# EAGLE design XOR_XNOR_1.1 (EAGLE 7.6.0)
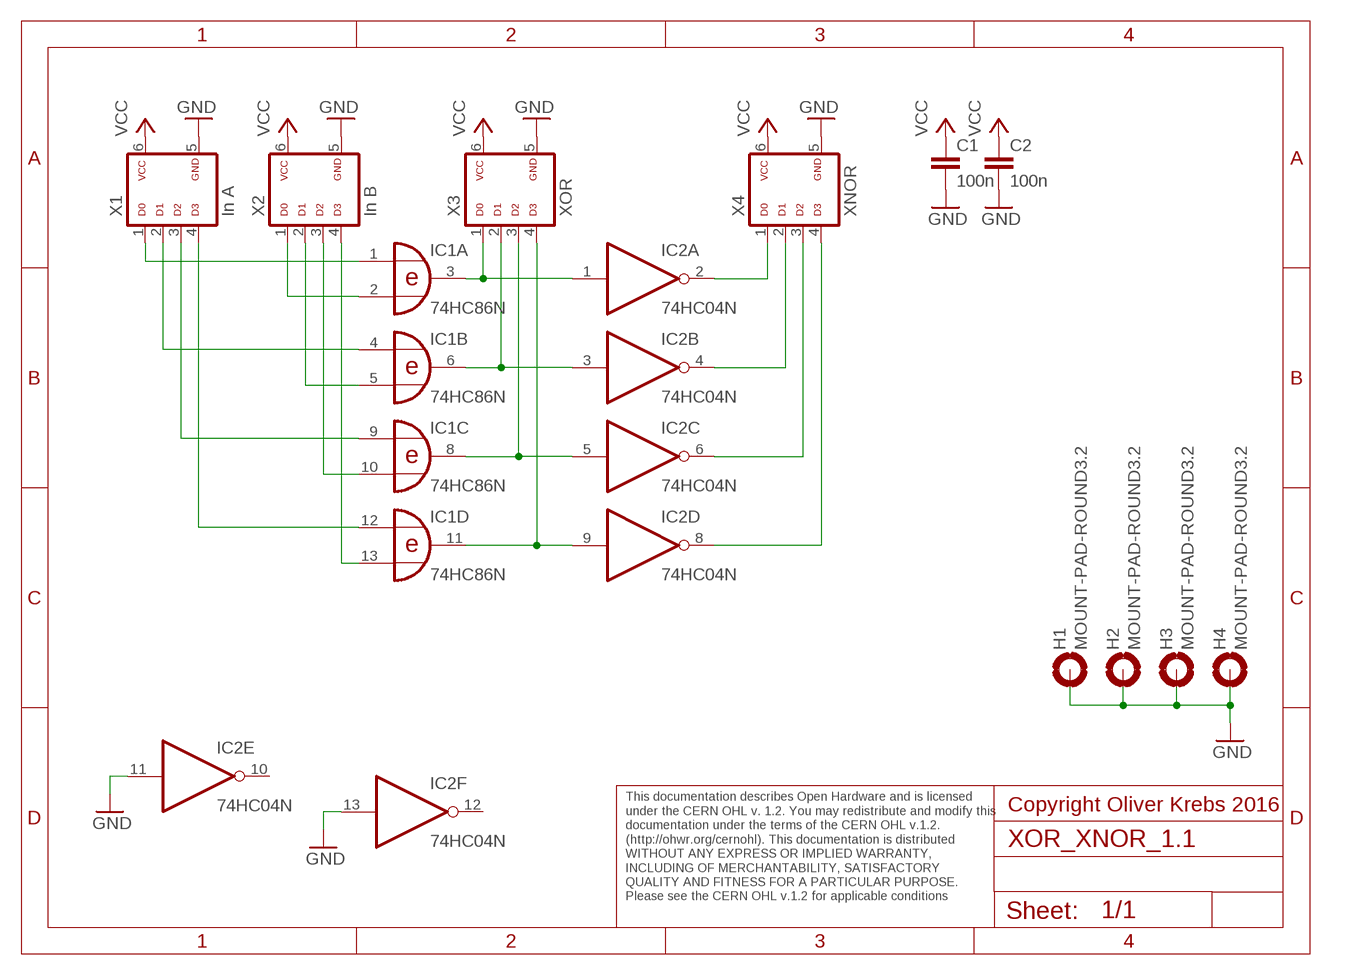
[diagram p0: schematic, sheet 1]

## Parts
C1  100n  C-EU050-025X075  [C050-025X075]
C2  100n  C-EU050-025X075  [C050-025X075]
H1  MOUNT-PAD-ROUND3.2  [3,2-PAD]
H2  MOUNT-PAD-ROUND3.2  [3,2-PAD]
H3  MOUNT-PAD-ROUND3.2  [3,2-PAD]
H4  MOUNT-PAD-ROUND3.2  [3,2-PAD]
IC1  74HC86N  [DIL14]
IC2  74HC04N  [DIL14]
X1  In A  ML6D  [ML-6]
X2  In B  ML6D  [ML-6]
X3  XOR  ML6D  [ML-6]
X4  XNOR  ML6D  [ML-6]

## Nets
GND: C1.2 C2.2 H1.B3,2(MOUNT) H2.B3,2(MOUNT) H3.B3,2(MOUNT) H4.B3,2(MOUNT) IC2.11(E:I) IC2.13(F:I) X1.5 X2.5 X3.5 X4.5
N$1: IC1.3(A:O) IC2.1(A:I) X3.1
N$2: IC1.6(B:O) IC2.3(B:I) X3.2
N$3: IC1.8(C:O) IC2.5(C:I) X3.3
N$4: IC1.11(D:O) IC2.9(D:I) X3.4
N$5: IC2.2(A:O) X4.1
N$6: IC2.4(B:O) X4.2
N$7: IC2.6(C:O) X4.3
N$8: IC2.8(D:O) X4.4
N$9: IC1.1(A:I0) X1.1
N$10: IC1.2(A:I1) X2.1
N$11: IC1.5(B:I1) X2.2
N$12: IC1.4(B:I0) X1.2
N$13: IC1.9(C:I0) X1.3
N$14: IC1.10(C:I1) X2.3
N$15: IC1.12(D:I0) X1.4
N$16: IC1.13(D:I1) X2.4
VCC: C1.1 C2.1 X1.6 X2.6 X3.6 X4.6
Unconnected: IC2.10(E:O) IC2.12(F:O)

## Notes on the sheet
- Copyright Oliver Krebs 2016
- This documentation describes Open Hardware and is licensed 
  under the CERN OHL v. 1.2. You may redistribute and modify this 
  documentation under the terms of the CERN OHL v.1.2. 
  (http://ohwr.org/cernohl). This documentation is distributed
  WITHOUT ANY EXPRESS OR IMPLIED WARRANTY, 
  INCLUDING OF MERCHANTABILITY, SATISFACTORY 
  QUALITY AND FITNESS FOR A PARTICULAR PURPOSE. 
  Please see the CERN OHL v.1.2 for applicable conditions

## Power pins joined to a net without a drawn wire
GND: IC1.7(P:GND) IC2.7(P:GND)
VCC: IC1.14(P:VCC) IC2.14(P:VCC)

## Library data of the parts
C1 C2 = 01-my_rcl:C-EU: CAPACITOR, European symbol
H1-H4 = holes:MOUNT-PAD-ROUND: MOUNTING PAD, round
IC1 = 74xx-eu:74*86: Quad 2-input EXCLUSIVE-OR (XOR) gate
IC2 = 74xx-eu:74*04: Hex INVERTER
X1-X4 = 01-my-con:ML6D

## Board
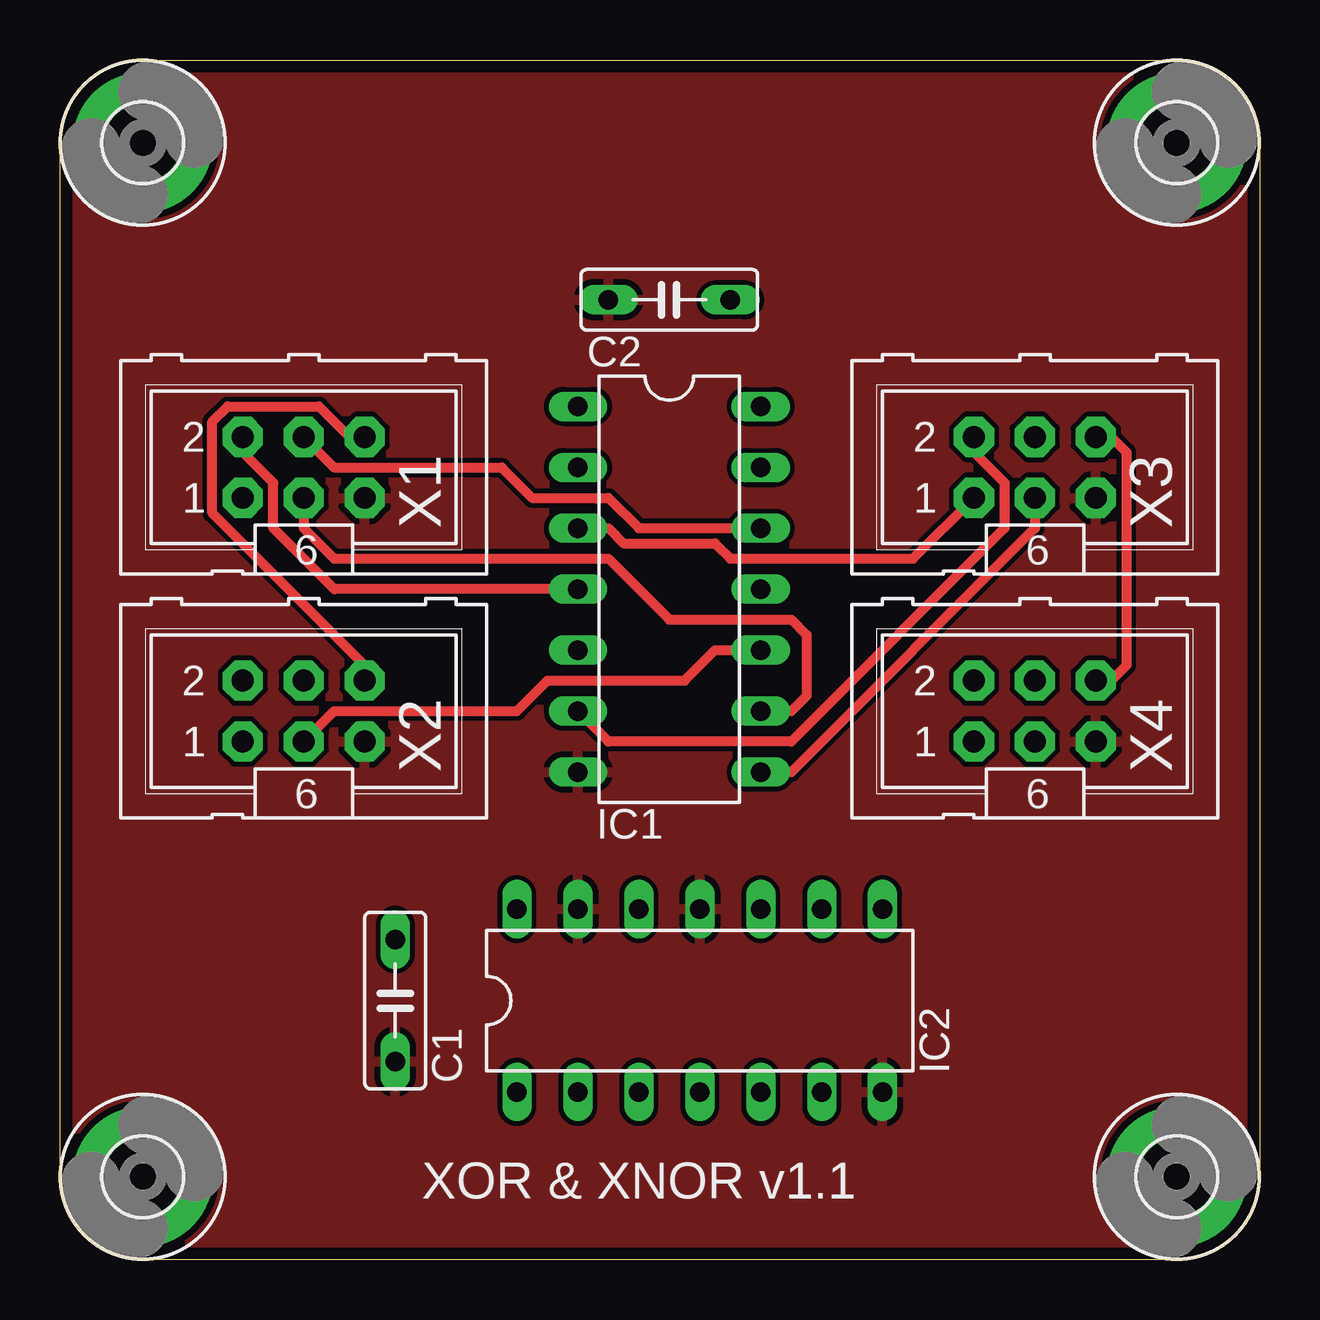
[diagram p1: board, top side]
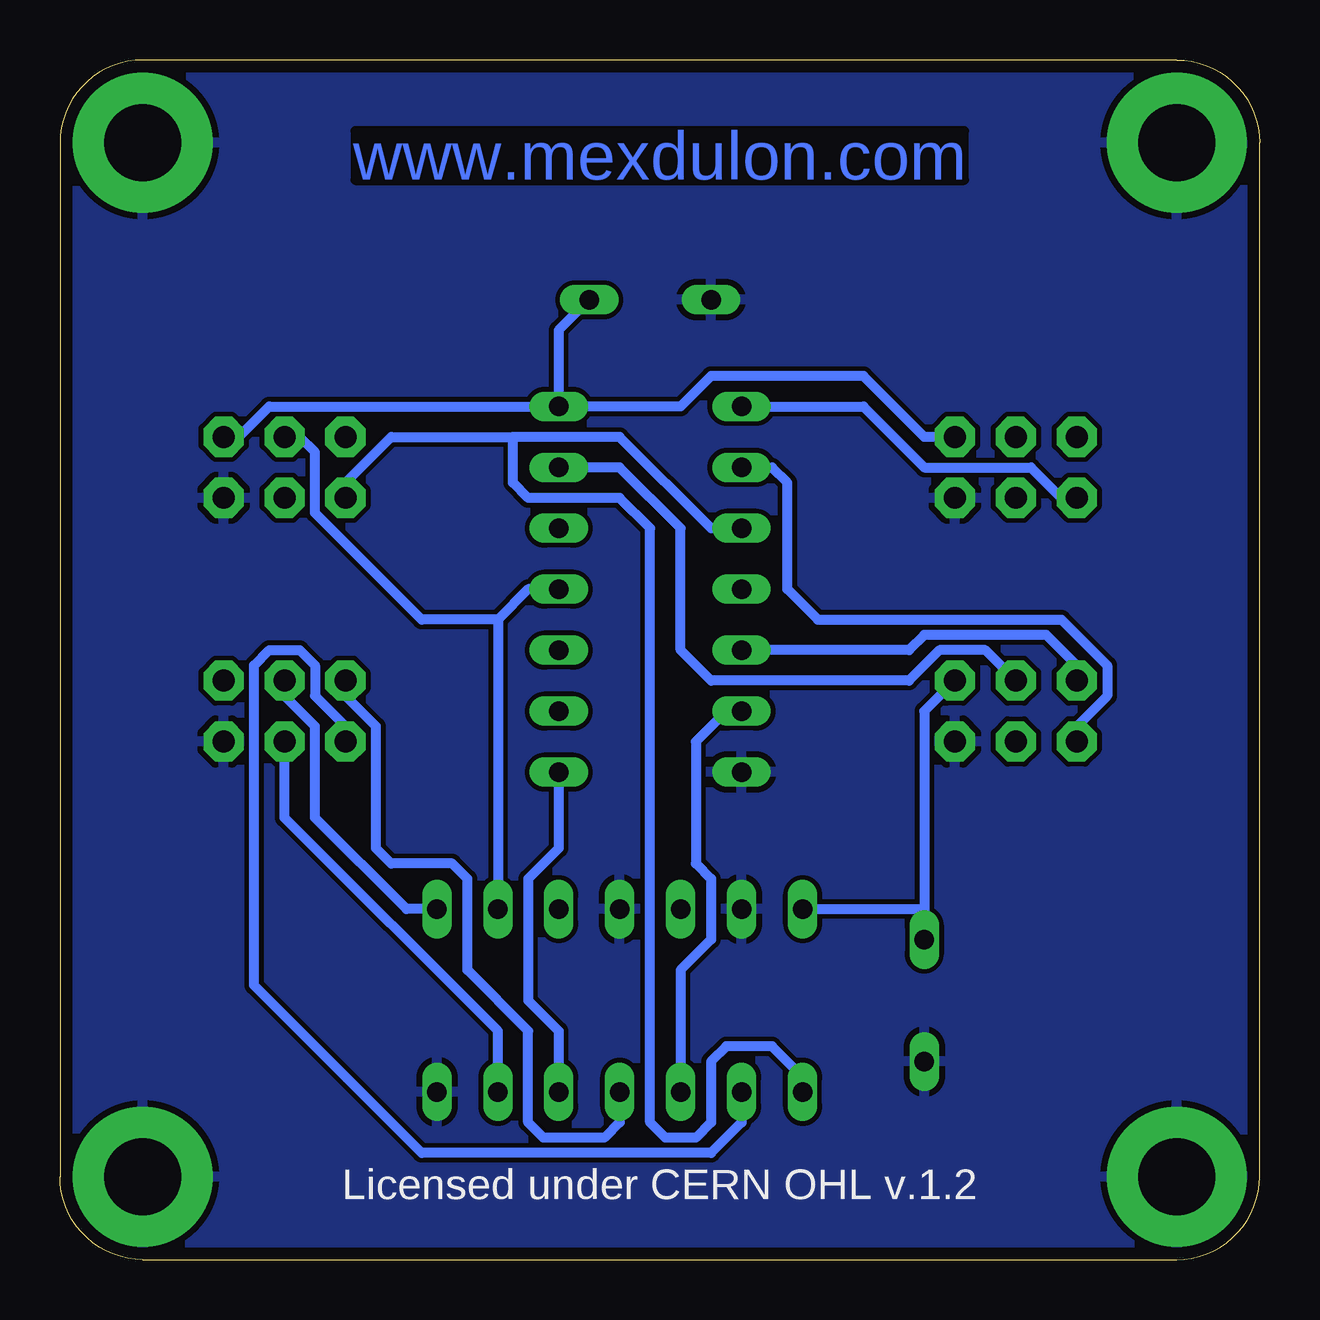
[diagram p2: board, bottom side, seen from below]

Size 50 x 50 mm. Coordinates in mm from the lower left corner, seen from the top.
Outline: 0,3.45 0,46.55 arc-90 3.45,50 46.55,50 arc-90 50,46.55 50,3.45 arc-90 46.55,0 3.45,0 arc-90 0,3.45
Copper layers (1*16): Top 0.035mm / dielectric 1.6mm / Bottom 0.035mm
Design rules "Elecrow_2-layer_PCB_eagle_rule": minimum track width 6mil, minimum drill 12mil, track to track 6mil, track to pad 6mil, pad to pad 6mil, via to via 8mil, smd to smd 0mil, copper to edge 20mil, drill to drill 10mil, minimum pad ring 6mil, minimum via ring 6mil, stop-mask expansion 0mil, vias tented up to drill 100mil, thermal gap 10mil

### Footprints (pad centres in the part's own frame; a part is rotated, then mirrored left to right if it is on the bottom)
C050-025X075 = drill 0.813 long: 1 -2.54,0; 2 2.54,0
3,2-PAD = drill 3.2 pad 5.842: B3,2 0,0
DIL14 = drill 0.813 long: 1 -7.62,-3.81; 2 -5.08,-3.81; 3 -2.54,-3.81; 4 0,-3.81; 5 2.54,-3.81; 6 5.08,-3.81; 7 7.62,-3.81; 8 7.62,3.81; 9 5.08,3.81; 10 2.54,3.81; 11 0,3.81; 12 -2.54,3.81; 13 -5.08,3.81; 14 -7.62,3.81
ML-6 = drill 0.914 pad 1.676 octagon: 1 -2.54,-1.27; 2 -2.54,1.27; 3 0,-1.27; 4 0,1.27; 5 2.54,-1.27; 6 2.54,1.27

### Placement (x,y rotation side)
C1  13.97,10.79 270 top
C2  25.4,40.01 180 top
H1  3.45,3.45 0 top
H2  3.45,46.55 0 top
H3  46.55,46.55 0 top
H4  46.55,3.45 0 top
IC1  25.4,27.94 270 top
IC2  26.67,10.79 0 top
X1  10.16,33.02 0 top
X2  10.16,22.86 0 top
X3  40.64,33.02 0 top
X4  40.64,22.86 0 top

### Tracks (layer width: path | path; a pad name or v marks a point on that pad's centre or on a via)
GND
  pour Bottom (isolate 0.203): 0,50.16 50.8,50.16 50.8,0 0,0
  pour Top (isolate 0.203): 0,50.16 50.8,50.16 50.8,0 0,0
N$1
  Top 0.406: IC1.3 22.86,30.48 23.5,29.84 27.3,29.84 27.94,29.21 35.56,29.21 X3.1
  Bottom 0.406: IC2.1 19.05,7.62 20.32,8.89 22.23,8.89 22.86,8.26 22.86,5.71 23.5,5.08 24.77,5.08 25.4,5.71 25.4,30.48 26.67,31.75 30.48,31.75 31.11,32.38 31.11,34.29 | X3.1 38.1,32.38 36.2,34.29 31.11,34.29 | IC1.3 22.86,30.48 26.67,34.29 31.11,34.29
N$2
  Top 0.406: X3.2 38.1,33.66 39.37,32.38 39.37,30.48 30.48,21.59 22.86,21.59 IC1.6
  Bottom 0.406: IC1.6 22.23,22.86 23.5,21.59 23.5,16.51 22.86,15.88 22.86,13.34 24.13,12.06 IC2.3
N$3
  Top 0.406: X3.3 40.64,30.48 30.48,20.32 IC1.8
  Bottom 0.406: IC1.8 29.21,17.14 30.48,15.88 30.48,10.79 29.21,9.53 IC2.5
N$4
  Bottom 0.406: IC1.11 30.48,27.94 31.75,26.67 | 31.75,26.67 IC2.9 | 31.75,26.67 34.92,26.67 39.37,31.11 39.37,33.66 40.01,34.29 X3.4
N$5
  Bottom 0.406: IC2.2 21.59,5.71 22.86,4.45 34.92,4.45 41.91,11.43 41.91,24.77 41.27,25.4 40.01,25.4 39.37,24.77 39.37,23.5 38.1,22.23 X4.1
N$6
  Bottom 0.406: IC2.4 26.67,5.71 27.3,5.08 29.84,5.08 30.48,5.71 30.48,9.53 33.02,12.06 33.02,15.88 33.66,16.51 36.2,16.51 36.83,17.14 36.83,22.23 38.1,23.5 X4.2
N$7
  Bottom 0.406: IC2.6 31.75,9.53 40.64,18.41 X4.3
N$8
  Bottom 0.406: IC2.8 35.56,14.61 39.37,18.41 39.37,22.23 40.64,23.5 X4.4
N$9
  Bottom 0.406: IC1.1 16.51,35.56 13.97,33.02 9.53,33.02 8.26,31.75 X1.1
N$10
  Bottom 0.406: X2.1 7.62,22.23 6.35,23.5 6.35,24.77 8.26,26.67 18.41,26.67 19.68,27.94 19.68,32.38 20.32,33.02 IC1.2
N$11
  Bottom 0.406: X2.2 7.62,24.77 8.89,26.04 13.97,26.04 14.61,25.4 IC1.5
N$12
  Top 0.406: IC1.4 11.43,27.94 8.89,30.48 8.89,32.38 7.62,33.66 X1.2
N$13
  Top 0.406: X1.3 10.16,30.48 11.43,29.21 22.86,29.21 25.4,26.67 30.48,26.67 31.11,26.04 31.11,23.5 30.48,22.86 IC1.9
N$14
  Top 0.406: X2.3 11.43,22.86 19.05,22.86 20.32,24.13 26.04,24.13 27.3,25.4 IC1.10
N$15
  Top 0.406: X1.4 11.43,33.02 18.41,33.02 19.68,31.75 22.86,31.75 24.13,30.48 IC1.12
N$16
  Bottom 0.406: X2.4 11.43,25.4 13.34,25.4 14.61,24.13 22.86,24.13 24.13,25.4 24.13,30.48 26.67,33.02 IC1.13
VCC
  Top 0.406: X2.6 12.7,24.77 6.35,31.11 6.35,34.92 6.99,35.56 10.79,35.56 12.06,34.29 X1.6 | X3.6 43.81,34.29 44.45,33.66 44.45,24.77 43.81,24.13 X4.6
  Bottom 0.406: X1.6 13.97,34.29 16.51,36.83 22.86,36.83 24.13,35.56 IC1.14 | IC1.14 41.27,35.56 42.55,34.29 X3.6 | X2.6 13.97,22.86 13.97,14.61 | 13.97,14.61 C1.1 | IC2.14 13.97,14.61 | C2.1 29.21,38.73 IC1.14

### Text on the board
Bottom: www.mexdulon.com
tNames: XOR & XNOR v1.1
bNames: Licensed under CERN OHL v.1.2